# Altium schematic sheet Transducer.SchDoc
size 508 x 254 mm; Author: David Arancibia González; CompanyName: Universidad de Santiago de Chile; Address1: Avenida Ecuador Nº 3519; Address2: Estación Central, Santiago; Address3: Chile; DocumentNumber: 3; SheetNumber: 3; SheetTotal: 3
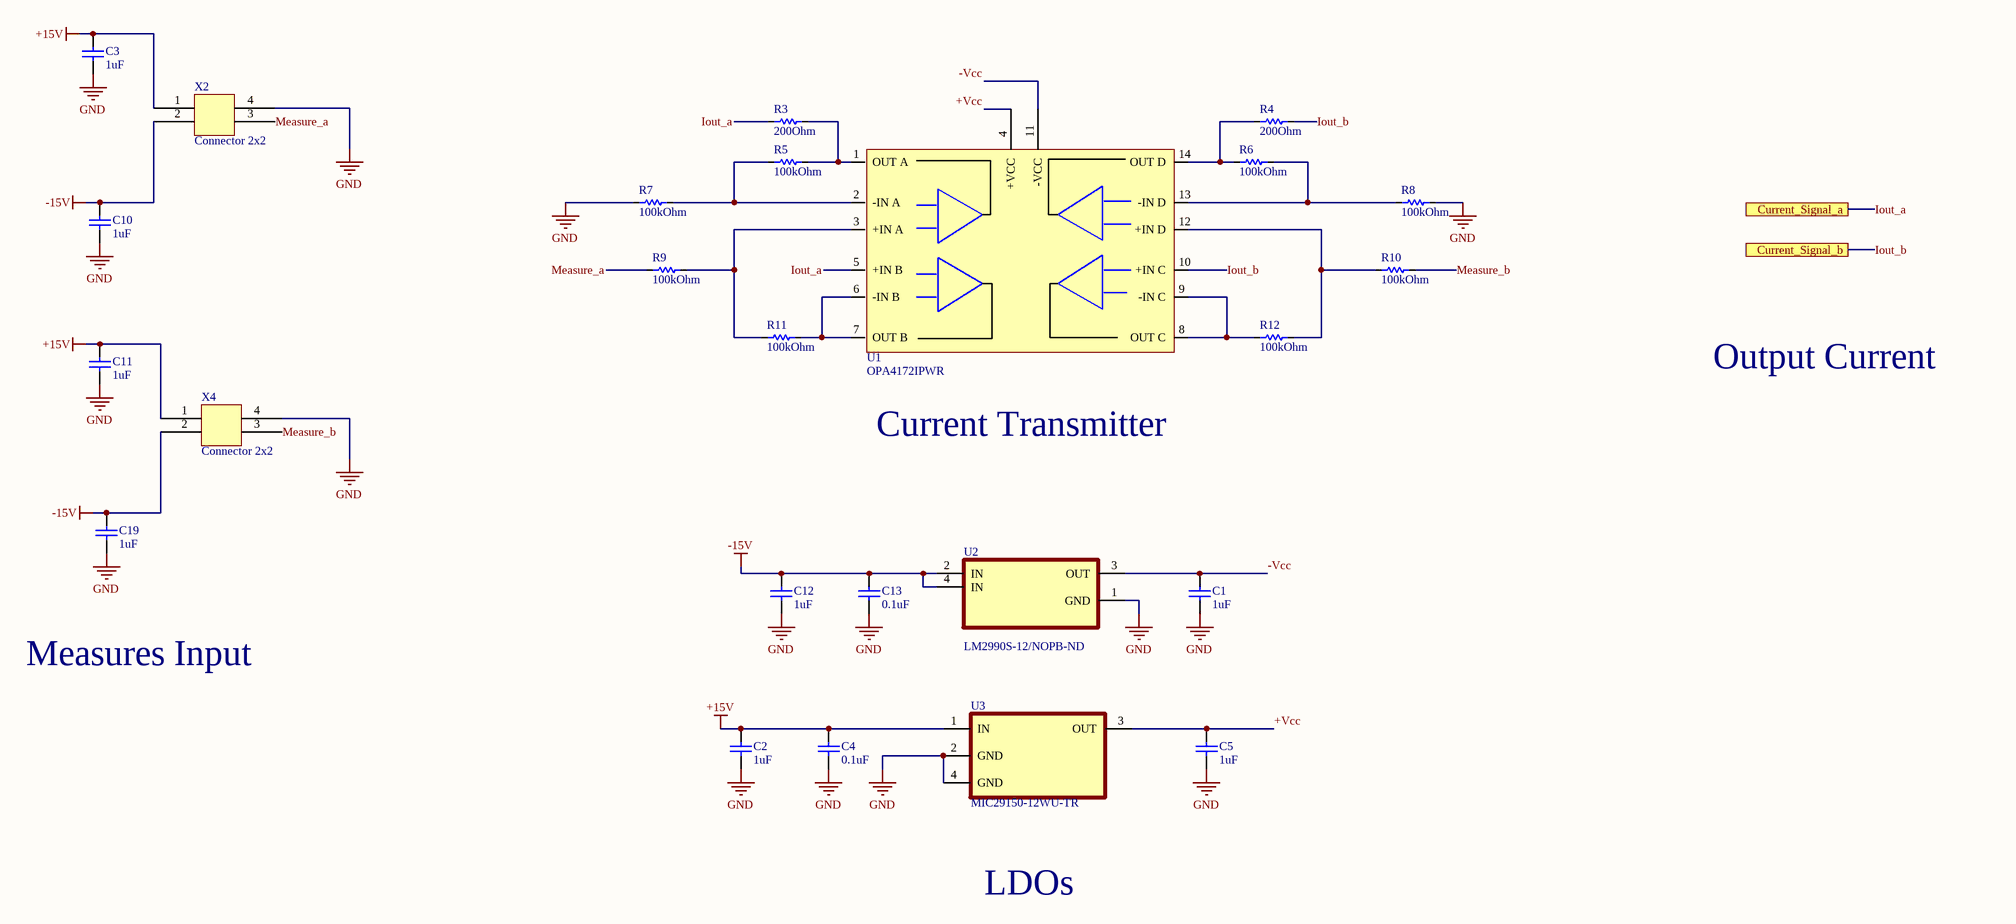
[diagram p0: Transducer.SchDoc]

## Parts
C1  1uF  [CAP_1206]
C2  1uF  [CAP_1206]
C3  1uF  [CAP_1206]
C4  0.1uF  [CAP_0603]
C5  1uF  [CAP_1206]
C10  1uF  [CAP_1206]
C11  1uF  [CAP_1206]
C12  1uF  [CAP_1206]
C13  0.1uF  [CAP_0603]
C19  1uF  [CAP_1206]
R3  200Ohm  [CAP_1206]
R4  200Ohm  [CAP_1206]
R5  100kOhm  [CAP_1206]
R6  100kOhm  [CAP_1206]
R7  100kOhm  [CAP_1206]
R8  100kOhm  [CAP_1206]
R9  100kOhm  [CAP_1206]
R10  100kOhm  [CAP_1206]
R11  100kOhm  [CAP_1206]
R12  100kOhm  [CAP_1206]
U1  OPA4172IPWR  [OPAx172]
U2  Supplier Part Number 1: LM2990S-12/NOPB-ND  [LM2990]  (hidden comment: LM2990S-12/NOPB)
U3  MIC29150-12WU-TR  [MIC29150]
X2  Connector 2x2  [0039310047]
X4  Connector 2x2  [0039310047]

## Ports
Current_Signal_a, Current_Signal_b

## Nets
+15V: C2.1 C3.1 C4.1 C11.1 U3.1(IN) X2.1 X4.1
-15V: C10.1 C12.1 C13.1 C19.1 U2.2(IN) U2.4(IN) X2.2 X4.2
GND: C1.2 C2.2 C3.2 C4.2 C5.2 C10.2 C11.2 C12.2 C13.2 C19.2 R7.2 R8.1 U2.1(GND) U3.2(GND) U3.4(GND) X2.4 X4.4
+Vcc: C5.1 U1.4(+VCC) U3.3(OUT)
-Vcc: C1.1 U1.11(-VCC) U2.3(OUT)
Iout_a: R3.2 U1.5(+IN_B) ; port Current_Signal_a
Iout_b: R4.1 U1.10(+IN_C) ; port Current_Signal_b
Measure_a: R9.2 X2.3
Measure_b: R10.1 X4.3
NetR3_1: R3.1 R5.1 U1.1(OUT_A)
NetR4_2: R4.2 R6.2 U1.14(OUT_D)
NetR5_2: R5.2 R7.1 U1.2(-IN_A)
NetR6_1: R6.1 R8.2 U1.13(-IN_D)
NetR9_1: R9.1 R11.2 U1.3(+IN_A)
NetR10_2: R10.2 R12.1 U1.12(+IN_D)
NetR11_1: R11.1 U1.6(-IN_B) U1.7(OUT_B)
NetR12_2: R12.2 U1.8(OUT_C) U1.9(-IN_C)

## Notes on the sheet
- Output Current
- Current Transmitter
- Measures Input
- LDOs
- Title
- Size:
- Date:
- A4
- Revision:
- Time:
- Sheet
- of
- Author:
- Project:

## Library data of the parts
C1-C3 C5 C10-C12 C19 = GMK316B7105MLHT: Cap Ceramic 1uF 35V X7R 20% Pad SMD 1206 125C Low ESR Automotive T/R; Manufacturer: Taiyo Yuden; Supplier 1: Digi-Key; Supplier Part Number 1: 587-GMK316B7105MLHTCT-ND; Manufacturer Part Number: GMK316B7105MLHT; RoHS: Yes; Category: Ceramic Capacitors; Stock 1: 1568; Pricing 1: 1=0,26000, 10=0,17900, 50=0,11920, 100=0,10130, 500=0,07148, 1000=0,06255 (USD)
C4 C13 = C1608X5R1H104K080AA: Cap Ceramic 0.1uF 50V X5R 10% SMD 0603 85C T/R; Manufacturer: TDK; Capacitance: 100nF; Supplier 1: Digi-Key; Supplier Part Number 1: 445-7456-1-ND; Manufacturer Part Number: C1608X5R1H104K080AA; RoHS: Yes; Category: Ceramic Capacitors; Stock 1: 1984; Pricing 1: 1=0,12000, 10=0,08600, 50=0,04680, 100=0,03830, 500=0,02734, 1000=0,02148 (USD); Mount: Surface Mount; Case/Package: 0603; Number of Pins: 2; Case Code (Metric): 1608; Case Code (Imperial): 0603; Dielectric Material: Ceramic; Weight: 7.1E-05oz; Min Operating Temperature: -55°C; Max Operating Temperature: 85°C; Tolerance: 10%; Dielectric: X5R; Voltage Rating: 50V; Packaging: Tape and Reel; Voltage Rating (DC): 50V; Termination: SMD/SMT; Package Quantity: 1; Resistor Type: Ceramic; Series: C; Construction: Flat; Length: 1.6mm; Width: 0.031inch; Height: 0.8mm; Depth: 0.8mm; Thickness: 0.035inch; Radiation Hardening: No; REACH SVHC: No SVHC; Lead Free: Lead Free; RoHS Compliant: Yes; ComponentLink1URL: https://datasheet.ciiva.com/26834/getdatasheetpartid-733538-26834367.pdf?src-supplier=Verical; ComponentLink1Description: https://datasheet.ciiva.com/26834/getdatasheetpartid-733538-26834367.pdf?src-supplier=Verical; ComponentLink2URL: https://datasheet.ciiva.com/28577/1735394-28577228.pdf?src-supplier=Element14; ComponentLink2Description: https://datasheet.ciiva.com/28577/1735394-28577228.pdf?src-supplier=Element14; ComponentLink3URL: https://datasheet.ciiva.com/6275/tdkmlcccaprange-6275223.pdf?src-supplier=Digi-Key; ComponentLink3Description: https://datasheet.ciiva.com/6275/tdkmlcccaprange-6275223.pdf?src-supplier=Digi-Key; ComponentLink4URL: https://datasheet.ciiva.com/24219/mlcc-commercial-general-en-24219452.pdf?src-supplier=Mouser; ComponentLink4Description: https://datasheet.ciiva.com/24219/mlcc-commercial-general-en-24219452.pdf?src-supplier=Mouser; ComponentLink5URL: https://datasheet.ciiva.com/17487/e412-c-17487525.pdf?src-supplier=Avnet+Europe; ComponentLink5Description: https://datasheet.ciiva.com/17487/e412-c-17487525.pdf?src-supplier=Avnet+Europe; ComponentLink6URL: https://datasheet.ciiva.com/7975/1796654-7975081.pdf?src-supplier=Element14; ComponentLink6Description: https://datasheet.ciiva.com/7975/1796654-7975081.pdf?src-supplier=Element14; ComponentLink7URL: https://datasheet.ciiva.com/22694/1796654-22694121.pdf?src-supplier=Element14; ComponentLink7Description: https://datasheet.ciiva.com/22694/1796654-22694121.pdf?src-supplier=Element14
R3 R4 = ERA8AEB201V: Res Thin Film 1206 200 Ohm 0.1% 1/4W ±25ppm/°C Molded SMD SMD Punched Carrier T/R; Manufacturer: Panasonic; Resistance: 200R; Power Rating: 250mW; Voltage Rating: 150V; Supplier 1: RSComponents; Supplier Part Number 1: 8280667P; Manufacturer Part Number: ERA8AEB201V; RoHS: Yes; Category: Chip SMD Resistors; Stock 1: 1780; Pricing 1: 50=0,57000, 100=0,53200, 250=0,49600, 500=0,45200 (GBP); Mount: Surface Mount; Case/Package: 1206; Case Code (Metric): 3216; Case Code (Imperial): 1206; Min Operating Temperature: -55°C; Max Operating Temperature: 155°C; Package Quantity: 5000; Tolerance: 0.1%; Packaging: Tape and Reel; Resistor Type: Thin Film,Metal Film; Number of Terminations: 2; Termination: SMD/SMT; Temperature Coefficient: 25ppm/°C; Max Power Dissipation: 250mW; Voltage Rating (DC): 150V; Series: ERA-8A; Construction: Rectangular; Technology: THIN FILM; Length: 3.2mm; Width: 0.063inch; Height: 0.6mm; Depth: 1.6mm; Military Standard: Not; Lead Free: Lead Free; RoHS Compliant: Yes; ComponentLink1URL: https://datasheet.ciiva.com/43458/391390-43458059.pdf?src-supplier=Farnell; ComponentLink1Description: https://datasheet.ciiva.com/43458/391390-43458059.pdf?src-supplier=Farnell; ComponentLink2URL: https://datasheet.ciiva.com/46444/391390-46444809.pdf?src-supplier=Element14; ComponentLink2Description: https://datasheet.ciiva.com/46444/391390-46444809.pdf?src-supplier=Element14; Number of Pins: 2; Contact Plating: Tin; Resistance Tolerance: 0.1%; Radiation Hardening: No; REACH SVHC: No SVHC
R5-R12 = AT1206BRD07100KL: Chip Resistor Automotive Grade Thin Film 1206 100kOhm 0.1% Paper T/R; Manufacturer: Yageo; Resistance: 100kR; Max Power Dissipation: 250mW; Temperature Coefficient: 25ppm/°C; Supplier 1: Newark; Manufacturer Part Number: AT1206BRD07100KL; RoHS: Yes; Category: Chip SMD Resistors; Stock 1: 17700; Pricing 1: 10=0,31400, 25=0,27200, 50=0,23000, 100=0,18800 (USD); Case/Package: 1206; Min Operating Temperature: -55°C; Max Operating Temperature: 155°C; Packaging: Tape and Reel; Resistor Type: Thin Film; Number of Terminations: 2; Tolerance: 0.1%; Features: Moisture Resistant,Automotive AEC-Q200,Anti-Sulfur; Length: 0.122inch; Width: 0.063inch; Height: 0.026inch; RoHS Compliant: Yes; ComponentLink1URL: http://www.yageo.com/documents/recent/PYu-AT_51_RoHS_L_5.pdf?src-supplier=Digi-Key; ComponentLink1Description: http://www.yageo.com/documents/recent/PYu-AT_51_RoHS_L_5.pdf?src-supplier=Digi-Key; Supplier Part Number 1: 82AH6640
U1 = OPA4172IPWR: 4-Channel, 10-MHz, 36V, high slew-rate, low-noise, RRO, op amp 14-TSSOP -40 to 125; Manufacturer: Texas Instruments; Number of Circuits: 4; Slew Rate: 10V/µs; Gain Bandwidth Product: 10MHz; Input Bias Current: 8pA; Input Offset Voltage (Vos): 200uV; Operating Supply Current: 1.6mA; Output Current per Channel: 75mA; Supplier 1: Digi-Key; Manufacturer Part Number: OPA4172IPWR; RoHS: Yes; Category: Amplifiers - Op Amps, Buffer, Instrumentation; Stock 1: 1581; Pricing 1: 1=3,08000, 10=2,76500, 25=2,61400, 100=2,26540, 250=2,14924, 500=1,92852, 1000=1,91800 (USD); Mount: Surface Mount; Case/Package: TSSOP; Min Operating Temperature: -40°C; Max Operating Temperature: 125°C; Packaging: Tape and Reel; Number of Channels: 4; Lead Free: Lead Free; RoHS Compliant: Yes; ComponentLink1URL: http://www.ti.com/lit/ds/symlink/opa2172.pdf?src-supplier=Digi-Key; ComponentLink1Description: http://www.ti.com/lit/ds/symlink/opa2172.pdf?src-supplier=Digi-Key; ComponentLink2URL: http://www.ti.com/lit/gpn/opa4172?src-supplier=Mouser; ComponentLink2Description: http://www.ti.com/lit/gpn/opa4172?src-supplier=Mouser; Supplier Part Number 1: 296-OPA4172IPWRCT-ND
U2 = LM2990S-12/NOPB: 1-A, negative low-dropout voltage regulator 3-DDPAK/TO-263 -40 to 125; Manufacturer: TI National Semiconductor; Max Input Voltage: 300mV; Output Voltage: -12V; Number of Outputs: 1; Min Input Voltage: -26V; Quiescent Current: 5mA; Accuracy: 5%; Output Type: Fixed; Dropout Voltage: 600mV; Output Current: 1A; Current Rating: 1.5kA; Min Supply Voltage: -1V; Supplier 1: Digi-Key; Manufacturer Part Number: LM2990S-12/NOPB; Stock 1: 420; Pricing 1: 1 = 4,65000, 10 = 4,17800, 25 = 3,94960, 100 = 3,42300, 250 = 3,24740, 500 = 2,91390, 1000 = 2,89800 (USD); RoHS: Yes; Mount: Surface Mount; Case/Package: TO-263; Number of Pins: 3; Weight: 0.25lb; Contact Plating: Tin,Matte; Min Operating Temperature: -40°C; Max Operating Temperature: 125°C; Polarity: Negative; Package Quantity: 45; Packaging: Rail/Tube; Max Output Current: 1A; Output Voltage Accuracy: 5%; Max Supply Voltage: 300mV; Nominal Output Voltage: -12V; Max Output Voltage: -12V; Termination: SMD/SMT; Length: 10.16mm; Width: 8.64mm; Height: 4.57mm; Radiation Hardening: No; Lead Free: Contains Lead; REACH SVHC: No SVHC; RoHS Compliant: Yes; ComponentLink1URL: https://datasheet.ciiva.com/14666/0900766b80b13b16-14666451.pdf?src-supplier=RSComponents; ComponentLink1Description: https://datasheet.ciiva.com/14666/0900766b80b13b16-14666451.pdf?src-supplier=RSComponents; ComponentLink2URL: https://datasheet.ciiva.com/14149/lm2990-eng-tds-14149994.pdf?src-supplier=Distrelec; ComponentLink2Description: https://datasheet.ciiva.com/14149/lm2990-eng-tds-14149994.pdf?src-supplier=Distrelec
U3 = MIC29150-12WU-TR: LDO Regulator Pos 12V 1.5A Automotive 4-Pin(3+Tab) TO-263 T/R; Manufacturer: Microchip; Dropout Voltage: 350mV; Number of Regulators: 1; Supplier 1: Newark; Manufacturer Part Number: MIC29150-12WU-TR; Stock 1: 3000; Pricing 1: 750 = 3,26000 (USD); RoHS: Yes; Mount: Surface Mount; Case/Package: TO-263-4; Number of Pins: 4; Min Operating Temperature: -40°C; Max Operating Temperature: 125°C; Package Quantity: 750; Packaging: Tape and Reel; Output Voltage: 12V; Output Current: 1.5A; Series: -; Lead Free: Lead Free; RoHS Compliant: Yes; ComponentLink1URL: https://datasheet.ciiva.com/26907/mic29150-12wutr-26907428.pdf?src-supplier=IIIC; ComponentLink1Description: https://datasheet.ciiva.com/26907/mic29150-12wutr-26907428.pdf?src-supplier=IIIC; ComponentLink2URL: https://datasheet.ciiva.com/2064/mic29150-2064514.pdf?src-supplier=Digi-Key; ComponentLink2Description: https://datasheet.ciiva.com/2064/mic29150-2064514.pdf?src-supplier=Digi-Key; Supplier Part Number 1: 79AH4265
X2 X4 = 0039310047: Mini-Fit Jr. Vertical Header, 4.20mm Pitch, Dual Row, 4 Circuits, without Snap-in Plastic Peg PCB Lock, Gold, Natural; Manufacturer: Molex; Max Voltage Rating (DC): 600V; Number of Positions: 4; Gender: Female; Current Rating: 9A; Number of Ports: 1; Pitch: 4.2mm; Row Spacing: 0.165inch; Contact Post Length: 3.5mm; Glow Wire Compliant: Non-compliant; Supplier 1: Digi-Key; Supplier Part Number 1: WM16949-ND; Manufacturer Part Number: 0039310047; RoHS: Yes; Category: Headers and Wire Housings; Stock 1: 4580; Pricing 1: 1=1,76000, 10=1,49800, 100=1,23730, 1000=0,97682, 5000=0,86611, 10000=0,84657 (USD); Mount: Through Hole; Contact Plating: Gold; Contact Material: Brass; Color: Natural; Housing Material: Nylon; Min Operating Temperature: -40°C; Max Operating Temperature: 105°C; Number of Rows: 2; Packaging: Bulk; Termination: Solder; Orientation: Straight; Series: Mini-Fit® Jr™ 5566; Contact Type: Male Pin; Max Voltage Rating (AC): 600V; Contact Gender: Male; Voltage Rating: 600V; Number of Contacts: 4; Number of Circuits: 4; Fastening Type: Ramp; Depth: 11mm; Halogen Free: Low Halogen; ComponentLink1URL: https://datasheet.ciiva.com/6813/039281103-sd-6813992.pdf?src-supplier=Digi-Key; ComponentLink1Description: https://datasheet.ciiva.com/6813/039281103-sd-6813992.pdf?src-supplier=Digi-Key; ComponentLink2URL: https://datasheet.ciiva.com/5155/0039310047-pcb-headers-160037-5155238.pdf?src-supplier=Mouser; ComponentLink2Description: https://datasheet.ciiva.com/5155/0039310047-pcb-headers-160037-5155238.pdf?src-supplier=Mouser; ComponentLink3URL: https://datasheet.ciiva.com/30208/0039310047-pcb-headers-30208434.pdf?src-supplier=Onlinecomponents.com; ComponentLink3Description: https://datasheet.ciiva.com/30208/0039310047-pcb-headers-30208434.pdf?src-supplier=Onlinecomponents.com